# Altium schematic sheet Counter_Display_v1_dynamicLED.SchDoc
size A3; SPICEModelCacheEMTSWJOG: <root> / <DocumentId>EMTSWJOG</DocumentId> / <CacheFrame Number="0"> / <Model Name="cap" Kind="MDL"> / <Text>*Default semiconductor capacitor / .MODEL CAP C()</Text> / </Model> / </CacheFrame> / </root>; ENG_APP_DATE: --/--/--; DSN_APP_DATE: --/--/--; CHK_APP_DATE: --/--/--; Organization: Infineon AG; Address3: Germany; DocumentNumber: 1; SheetNumber: 1; SheetTotal: 1
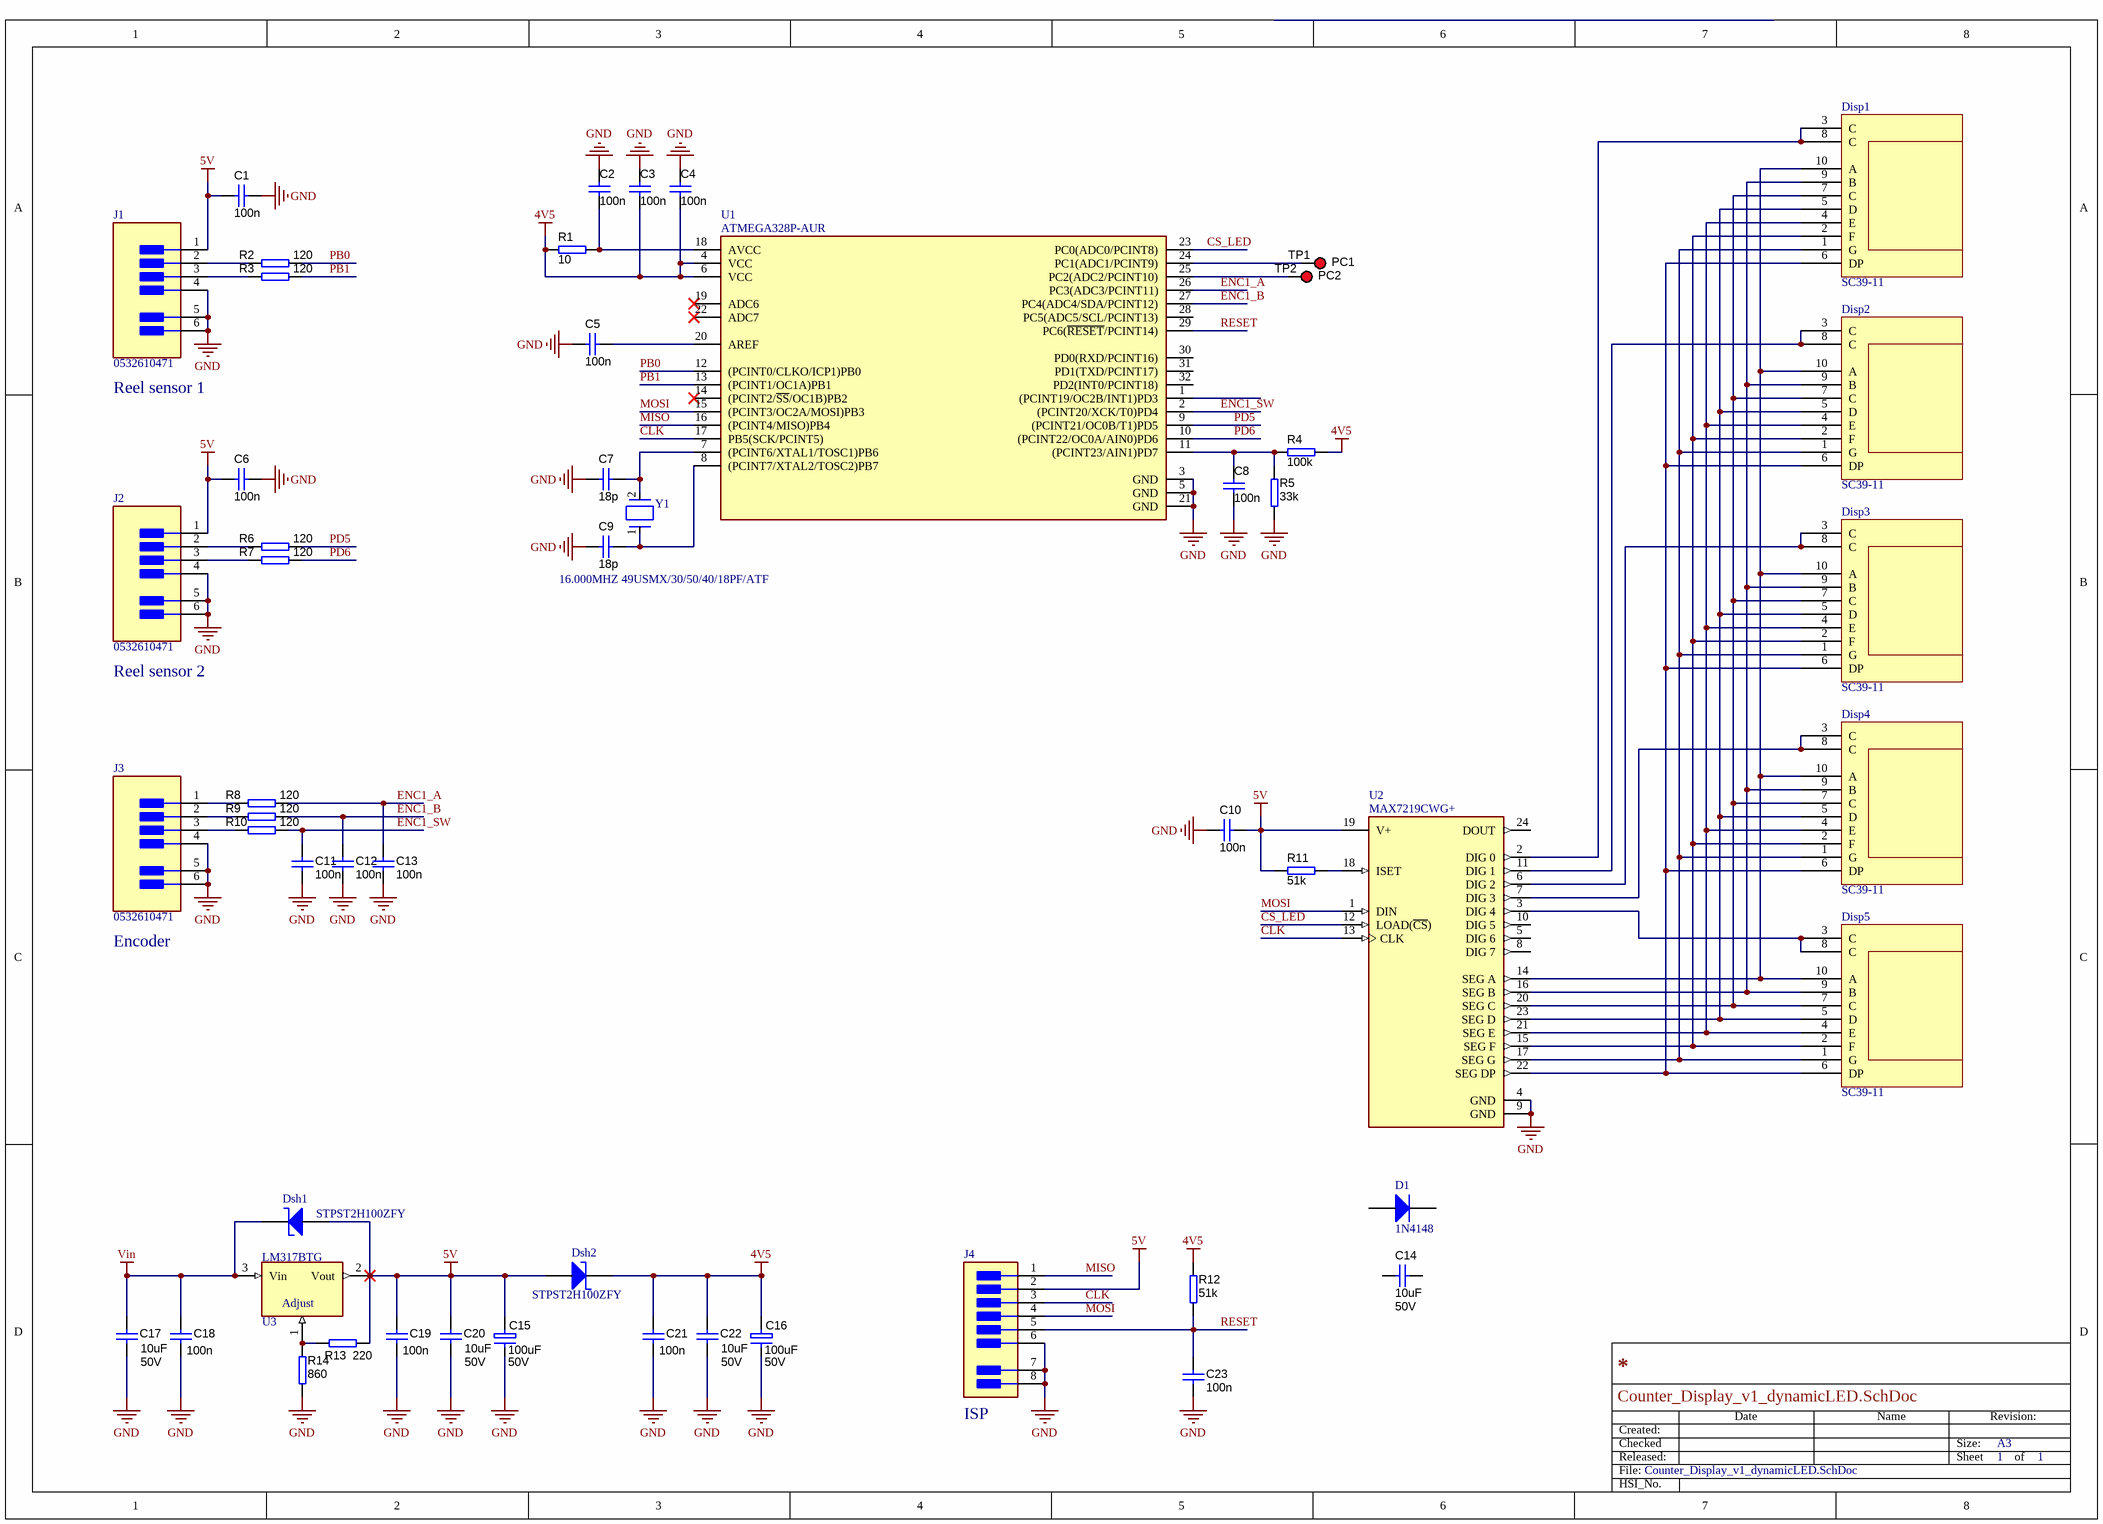
[diagram p0: Counter_Display_v1_dynamicLED.SchDoc]

## Parts
C1  value 100n  [0805_HV]
C2  value 100n  [0805_HV]
C3  value 100n  [0805_HV]
C4  value 100n  [0805_HV]
C5  value 100n  [0805_HV]
C6  value 100n  [0805_HV]
C7  value 18p  [0805_HV]
C8  value 100n  [0805_HV]
C9  value 18p  [0805_HV]
C10  value 100n  [0805_HV]
C11  value 100n  [0805_HV]
C12  value 100n  [0805_HV]
C13  value 100n  [0805_HV]
C14  value 10uF  Value1: 50V  [1206_180]
C15  value 100uF  Value1: 50V  [Elco_Flat_v1]
C16  value 100uF  Value1: 50V  [Elco_Flat_v1]
C17  value 10uF  Value1: 50V  [1206_180]
C18  value 100n  [1206]
C19  value 100n  [0805_HV]
C20  value 10uF  Value1: 50V  [1206_180]
C21  value 100n  [0805_HV]
C22  value 10uF  Value1: 50V  [1206_180]
C23  value 100n  [0805_HV]
D1  value 1N4148  [1N4148 (1005)]  (hidden comment: DIODE_MINI_MELF)
Disp1  SC39-11  [7-Segment-LED  (SC39-11G)]
Disp2  SC39-11  [7-Segment-LED  (SC39-11G)]
Disp3  SC39-11  [7-Segment-LED  (SC39-11G)]
Disp4  SC39-11  [7-Segment-LED  (SC39-11G)]
Disp5  SC39-11  [7-Segment-LED  (SC39-11G)]
Dsh1  value STPST2H100ZFY  [ONSC-SOD-123-2-425-04_V]  (hidden comment: DIODE_Shottky)
Dsh2  value STPST2H100ZFY  [ONSC-SOD-123-2-425-04_V]  (hidden comment: DIODE_Shottky)
J1  0532610471  [Molex_0532610471_0]
J2  0532610471  [Molex_0532610471_0]
J3  0532610471  [Molex_0532610471_0]
J4  53261-0671  [Molex_53261-0671_0]  (value not drawn)
R1  value 10  [0805_HV]
R2  value 120  [0805_HV]
R3  value 120  [0805_HV]
R4  value 100k  [0805_HV]
R5  value 33k  [0805_HV]
R6  value 120  [0805_HV]
R7  value 120  [0805_HV]
R8  value 120  [0805_HV]
R9  value 120  [0805_HV]
R10  value 120  [0805_HV]
R11  value 51k  [0805_HV]
R12  value 51k  [0805_HV]
R13  value 220  [0805_HV]
R14  value 860  [0805_HV]
TP1  PC1  [TP]
TP2  PC2  [TP]
U1  Part Number: ATMEGA328P-AUR  [ATMEGA328P-AU_0]  (hidden comment: ATMEGA328P-AU)
U2  MAX7219CWG+  [Maxim_Integrated_W24-1_IPC_A]
U3  LM317BTG  [ON_Semi_221AB-01_0]  (value not drawn)
Y1  Part Number: 16.000MHZ 49USMX/30/50/40/18PF/ATF  [Quartz_16.000MHZ_49USMX-30-50-40-18PF-ATF_0]  (hidden comment: Qartz_16.000MHZ_49USMX-30-50-40-18PF-ATF_eec)

## Nets
4V5: C3.1 C4.1 C16.1 C21.1 C22.1 Dsh2.K R1.1 R4.2 R12.2 U1.4(VCC) U1.6(VCC)
5V: C1.1 C6.1 C10.2 C15.1 C19.1 C20.1 Dsh1.A Dsh2.A J1.1 J2.1 J4.2 R11.1 R13.1 U2.19(V+) U3.2(Vout)
GND: C1.2 C2.2 C3.2 C4.2 C5.2 C6.2 C7.2 C8.1 C9.2 C10.1 C11.1 C12.1 C13.1 C15.2 C16.2 C17.2 C18.2 C19.2 C20.2 C21.2 C22.2 C23.1 J1.4 J1.5(MNT_1) J1.6(MNT_2) J2.4 J2.5(MNT_1) J2.6(MNT_2) J3.4 J3.5(MNT_1) J3.6(MNT_2) J4.6 J4.7(MNT_1) J4.8(MNT_2) R5.1 R14.2 U1.3(GND) U1.5(GND) U1.21(GND) U2.4(GND) U2.9(GND)
Vin: C17.1 C18.1 Dsh1.K U3.3(Vin)
CLK: J4.3 U1.17(PB5(SCK/PCINT5)) U2.13(CLK)
CS_LED: U1.23(PC0(ADC0/PCINT8)) U2.12(LOAD(~{CS}))
ENC1_A: C13.2 R8.2 U1.26(PC3(ADC3/PCINT11))
ENC1_B: C12.2 R9.2 U1.27(PC4(ADC4/SDA/PCINT12))
ENC1_SW: C11.2 R10.2 U1.2((PCINT20/XCK/T0)PD4)
MISO: J4.1 U1.16((PCINT4/MISO)PB4)
MOSI: J4.4 U1.15((PCINT3/OC2A/MOSI)PB3) U2.1(DIN)
PB0: R2.2 U1.12((PCINT0/CLKO/ICP1)PB0)
PB1: R3.2 U1.13((PCINT1/OC1A)PB1)
PD5: R6.2 U1.9((PCINT21/OC0B/T1)PD5)
PD6: R7.2 U1.10((PCINT22/OC0A/AIN0)PD6)
RESET: C23.2 J4.5 R12.1 U1.29(PC6(~{RESET}/PCINT14))
NetC2_1: C2.1 R1.2 U1.18(AVCC)
NetC5_1: C5.1 U1.20(AREF)
NetC7_1: C7.1 U1.7((PCINT6/XTAL1/TOSC1)PB6) Y1.2
NetC8_2: C8.2 R4.1 R5.2 U1.11((PCINT23/AIN1)PD7)
NetC9_1: C9.1 U1.8((PCINT7/XTAL2/TOSC2)PB7) Y1.1
NetDisp1_1: Disp1.1(G) Disp2.1(G) Disp3.1(G) Disp4.1(G) Disp5.1(G) U2.17(SEG_G)
NetDisp1_2: Disp1.2(F) Disp2.2(F) Disp3.2(F) Disp4.2(F) Disp5.2(F) U2.15(SEG_F)
NetDisp1_3: Disp1.3(C) Disp1.8(C) U2.2(DIG_0)
NetDisp1_4: Disp1.4(E) Disp2.4(E) Disp3.4(E) Disp4.4(E) Disp5.4(E) U2.21(SEG_E)
NetDisp1_5: Disp1.5(D) Disp2.5(D) Disp3.5(D) Disp4.5(D) Disp5.5(D) U2.23(SEG_D)
NetDisp1_6: Disp1.6(DP) Disp2.6(DP) Disp3.6(DP) Disp4.6(DP) Disp5.6(DP) U2.22(SEG_DP)
NetDisp1_7: Disp1.7(C) Disp2.7(C) Disp3.7(C) Disp4.7(C) Disp5.7(C) U2.20(SEG_C)
NetDisp1_9: Disp1.9(B) Disp2.9(B) Disp3.9(B) Disp4.9(B) Disp5.9(B) U2.16(SEG_B)
NetDisp1_10: Disp1.10(A) Disp2.10(A) Disp3.10(A) Disp4.10(A) Disp5.10(A) U2.14(SEG_A)
NetDisp2_3: Disp2.3(C) Disp2.8(C) U2.11(DIG_1)
NetDisp3_3: Disp3.3(C) Disp3.8(C) U2.6(DIG_2)
NetDisp4_3: Disp4.3(C) Disp4.8(C) U2.7(DIG_3)
NetDisp5_3: Disp5.3(C) Disp5.8(C) U2.3(DIG_4)
NetJ1_2: J1.2 R2.1
NetJ1_3: J1.3 R3.1
NetJ2_2: J2.2 R6.1
NetJ2_3: J2.3 R7.1
NetJ3_1: J3.1 R8.1
NetJ3_2: J3.2 R9.1
NetJ3_3: J3.3 R10.1
NetR11_2: R11.2 U2.18(ISET)
NetR13_2: R13.2 R14.1 U3.1(Adjust)
NetTP1_1: TP1.1 U1.24(PC1(ADC1/PCINT9))
NetTP2_1: TP2.1 U1.25(PC2(ADC2/PCINT10))

Not connected (* = marked no-connect by the designer): C14 1 2; D1 A K; U1 1((PCINT19/OC2B/INT1)PD3) 14((PCINT2/~{SS}/OC1B)PB2)* 19(ADC6)* 22(ADC7)* 28(PC5(ADC5/SCL/PCINT13)) 30(PD0(RXD/PCINT16)) 31(PD1(TXD/PCINT17)) 32(PD2(INT0/PCINT18)); U2 5(DIG_6) 8(DIG_7) 10(DIG_5) 24(DOUT)

## Notes on the sheet
- (near J1) Reel sensor 1
- (near J2) Reel sensor 2
- (near J3) Encoder
- (near J4) ISP
- File:
- Created:
- Checked
- Released:
- Date
- Name
- Size:
- Sheet
- Revision:
- A3
- of
- HSI_No.

## Library data of the parts
C1-C13 C18 C19 C21 C23 = C0805: CAP, CERM, +/- 10%, X7S,  0805; CompType: Capacitor; Tolerance_%: 10; SizeArea_mm2: 2.5; SizeAreaWB_mm2: 6.75; SizeX_mm: 2; SizeY_mm: 1.25; SizeZ_mm: 1.45; Value1: 25V; PackageReference: 0805; MountType: SMT; Technology: Ceramic; TempCo: X7S
C14 C17 C20 C22 = C1206: CAP, CERM, NP0, 1206; Tolerance_%: 10; TempCo: X7R; TaMin_C: -55; TaMax_C: 125; SizeArea_mm2: 5.12; SizeAreaWB_mm2: 10.92; SizeX_mm: 3.2; SizeY_mm: 1.6; SizeZ_mm: 1.8; PackageReference: 1206; MountType: SMT; Technology: Ceramic
C15 C16 = C_Elco: CAP, Elco; Tolerance_%: 10; TempCo: X7R; TaMin_C: -55; TaMax_C: 125; SizeArea_mm2: 5.12; SizeAreaWB_mm2: 10.92; SizeX_mm: 3.2; SizeY_mm: 1.6; SizeZ_mm: 1.8; PackageReference: 1206; MountType: SMT; Technology: Ceramic
D1 = DIODE_MINI_MELF: Diode
Disp1-Disp5 = SC39-11: SC 39-11 GN
Dsh1 Dsh2 = DIODE_Shottky: Diode Shottky
R1-R14 = R0805: RES, 1%, 0.1 W, 0805; SizeX_mm: 2; SizeY_mm: 1.25; SizeZ_mm: 0.75; PackageReference: 0805; Value1: 1%; MountType: SMT
TP1 TP2 = TP: Test Point, Miniature, Red, TH; PartNumber: 5000; Manufacturer: Keystone; CNHeader: FALSE; ContactFinish: Silver; CT: TRUE; Green_Lifecycle: Active; Green_REACh: Passed; PackageReference: Red Miniature Testpoint; CompType: Test Point; RoHS: Y; MountType: TH; ComponentLink1Description: Datasheet URL; ComponentLink1URL: http://www.keyelco.com/userAssets/file/M60-2p60.pdf; Publisher: Texas Instruments; LatestRevisionDate: 26/05/2017; Supplier 1: Digi-Key; Supplier Part Number 1: 36-5000-ND; Supplier 2: Mouser; Supplier Part Number 2: 534-5000; Color: Red; Green_EU RoHS-2: Incomplete; Green_EU RoHS: Passed
U1 = ATMEGA328P-AU: IC AVR AVR® ATmega Microcontroller IC 8-Bit 20MHz 32KB (16K x 16) FLASH 32-TQFP (7x7); Manufacturer: Atmel; Mfg Package Ident: 32A; Num Pins: 32; helpURL: https://upverter.com/upn/revision/4a46e9701fb05de6/; ComponentLink2Description: Datasheet; Temperature: -40°C to +85°C; Package: 32A; Supplier 2: Mouser; Supplier 1: Digi-Key; ComponentLink1URL: https://upverter.com/upn/revision/4a46e9701fb05de6/; Supplier Part Number 2: 556-ATMEGA328P-AUR; Supplier Part Number 1: ATMEGA328P-AURCT-ND; ComponentLink1Description: Upverter; ComponentLink2URL: http://www.mouser.com/ds/2/36/atmel-8271-8-bit-avr-microcontroller-atmega48a-48p-365589.pdf; RoHS: TRUE; Mouser Part Number: 556-ATMEGA328P-AUR; Ipc Land Pattern Name: QFP80P900X900X120-32; Temperature Range High: +85°C; Digikey Description: IC AVR AVR® ATmega Microcontroller IC 8-Bit 20MHz 32KB (16K x 16) FLASH 32-TQFP (7x7); Digikey Part Number: ATMEGA328P-AURCT-ND; Land Pattern: http://www.atmel.com/Images/Atmel-8826-SEEPROM-PCB-Mounting-Guidelines-Surface-Mount-Packages-ApplicationNote.pdf; Lead Free: yes; Temperature Range Low: -40°C
Y1 = Qartz_16.000MHZ_49USMX-30-50-40-18PF-ATF_eec: CRYS; Manufacturer: Euroquartz; Category 008Acd80318Bdb4D: Crystals/Resonators/Oscillators; frequency: 16 MHz; Category 7542B8484461Ae85: Passive Components; Category 9Afb57F1Abf5413C: Crystals; load_capacitance: 18 pF; Num Pins: 2; helpURL: https://upverter.com/upn/revision/05c5f50b0b55a54c/; ComponentLink2Description: Datasheet; Temperature: -40°C to +85°C; Package: SMT_XTAL_11MM35_3MM68; Supplier 2: Mouser; Supplier 1: Digi-Key; ComponentLink1URL: https://upverter.com/upn/revision/05c5f50b0b55a54c/; ComponentLink1Description: Upverter; ComponentLink2URL: https://upverter.com/datasheet/0b0a610900101a63fb5a28c721a8a2dd099ef9d5.pdf; RoHS: TRUE; Temperature Range High: +85°C; Digikey Description: CRYS; Lead Free: yes; Temperature Range Low: -40°C; Octopart Part Number: 45978c55d5b29a50
U3 = LM317BTG: Part Number: LM317BTG